# EAGLE design Super-Regenerative-FM-KosmosX3000 (EAGLE 7.2.0)
Kosmos X3000, UKW-Pendler mit FET 11.Mar.09 11:01 by Wolfgang Holtmann http://www.radiomuseum.org/forum/kosmos_x3000_ukw_pendler_mit_fet.html
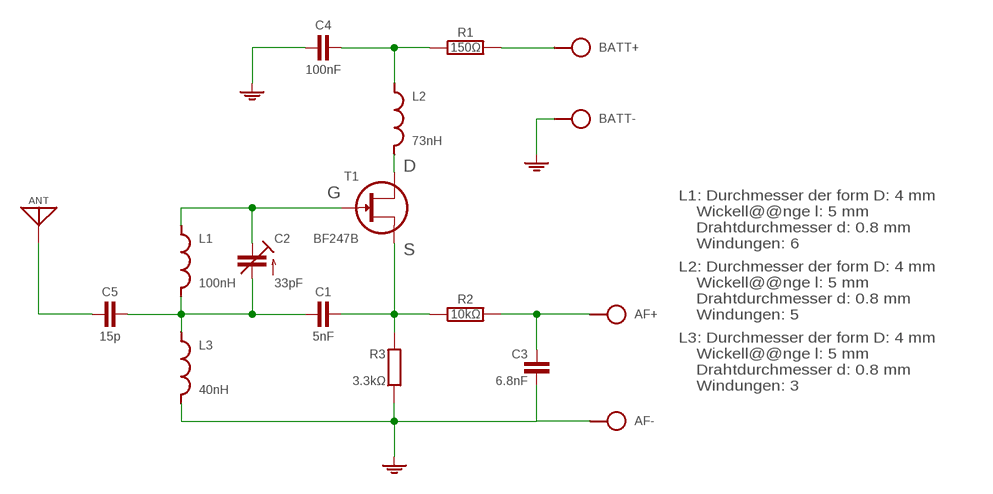
[diagram p0: schematic, sheet 1]

## Parts
AF  SPAD+-+-  [SPAD+-]
ANT  ANT  [SPAD]
BATT  SPAD+--+  [SPAD-+]
C1  5nF  C050-020X044  [C050-020X044]
C2  33pF  C-TR-PH201272222-808-2PIN  [TRIM-2222-808]
C3  6.8nF  C050-020X044  [C050-020X044]
C4  100nF  C050-020X044  [C050-020X044]
C5  15p  C025-015X024  [C025-015X024]
L1  100nH  L-SHORT04-5/5V-C  [L-04-5/6V-C]
L2  73nH  L-SHORT04-5/5V-C  [L-04-5/6V-C]
L3  40nH  L-SHORT04-5/5V-C  [L-04-5/6V-C]
R1  150Ω  R-H0204/15-V  [0204/15-V]
R2  10kΩ  R-H0204/10-V  [0204/10-V]
R3  3.3kΩ  R0204/10-V  [0204/10-V]
T1  BF247B  [TO92]

## Nets
GND: AF.1 BATT.1 C3.2 C4.2 L3.1 R3.2
N$1: C2.1(E) L1.2 T1.3(G)
N$2: C1.2 C2.2(A) C5.1 L1.1 L3.2
N$3: C4.1 L2.2 R1.1
N$4: AF.2 C3.1 R2.2
N$5: C1.1 R2.1 R3.1 T1.2(S)
N$6: L2.1 T1.1(D)
N$7: BATT.2 R1.2
N$8: ANT.1 C5.2

## Notes on the sheet
- L1: Durchmesser der form D: 4 mm
      Wickell@@nge l: 5 mm
      Drahtdurchmesser d: 0.8 mm
      Windungen: 6
- L2: Durchmesser der form D: 4 mm
      Wickell@@nge l: 5 mm
      Drahtdurchmesser d: 0.8 mm
      Windungen: 5
- L3: Durchmesser der form D: 4 mm
      Wickell@@nge l: 5 mm
      Drahtdurchmesser d: 0.8 mm
      Windungen: 3

## Library data of the parts
AF BATT = pad:SPAD+-
ANT = pad:ANT
C1 C3-C5 = c:C: CAPACITOR, European symbol
C2 = cap-trim:C-TR-PH20127
L1-L3 = l:L-SHORT
R1 R2 = r:R-H
R3 = r:R: RESISTOR, European symbol
T1 = t:BF247B

## Net classes
0 default: width 0.61 mm

## Board
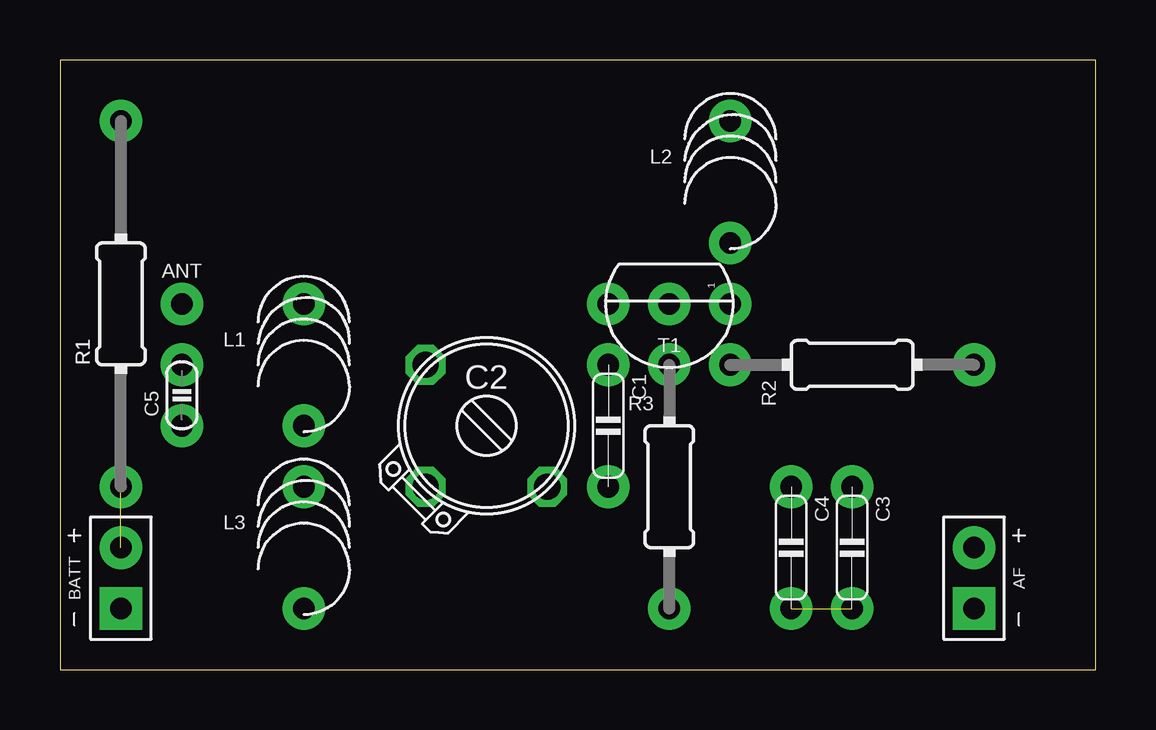
[diagram p1: board, top side]
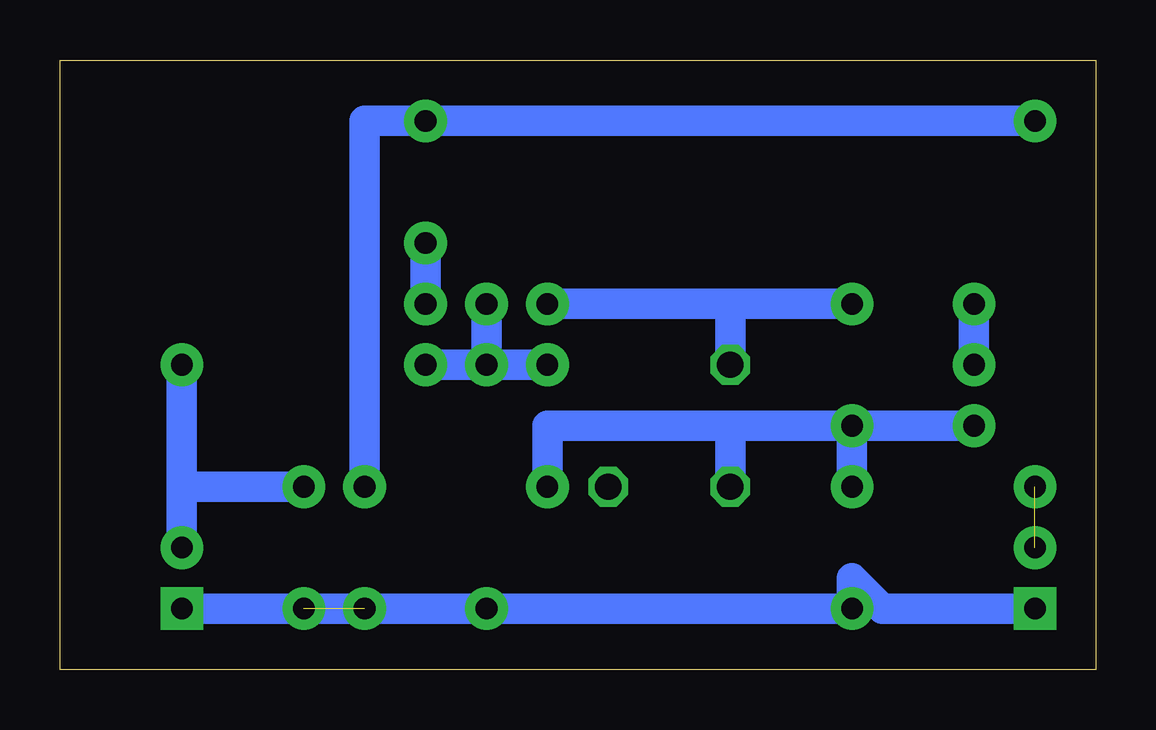
[diagram p2: board, bottom side, seen from below]

Size 43.18 x 25.4 mm. Coordinates in mm from the lower left corner, seen from the top.
Outline: 0,0 43.18,0 43.18,25.4 0,25.4 0,0
Copper layers (1*16): Top 0.035mm / dielectric 1.5mm / Bottom 0.035mm
Design rules "default": minimum track width 10mil, minimum drill 24mil, track to track 8mil, track to pad 8mil, pad to pad 8mil, via to via 8mil, smd to smd 8mil, copper to edge 40mil, drill to drill 8mil, minimum pad ring 10mil, minimum via ring 8mil, stop-mask expansion 4mil, vias tented up to drill 0mil, thermal gap 10mil

### Footprints (pad centres in the part's own frame; a part is rotated, then mirrored left to right if it is on the bottom)
SPAD+- = drill 0.9 pad 1.778 square: 1 0,-1.27 | drill 0.9 pad 1.778: 2 0,1.27
SPAD = drill 0.9 pad 1.778: 1 0,0
SPAD-+ = drill 0.9 pad 1.778 square: 1 0,-1.27 | drill 0.9 pad 1.778: 2 0,1.27
C050-020X044 = drill 0.9 pad 1.778: 1 -2.54,0; 2 2.54,0
TRIM-2222-808 = drill 1.1 octagon: 1 -2.54,2.54; 2 -2.54,-2.54; 3 2.54,-2.54
C025-015X024 = drill 0.9 pad 1.778: 1 -1.27,0; 2 1.27,0
L-04-5/6V-C = drill 0.9 pad 1.778: 1 0,-2.54; 2 0,2.54
0204/15-V = drill 0.9 pad 1.778: 1 0,7.62; 2 0,-7.62
0204/10-V = drill 0.9 pad 1.778: 1 0,5.08; 2 0,-5.08
TO92 = drill 0.9 pad 1.778: 1 0,2.54; 2 0,0; 3 0,-2.54

### Placement (x,y rotation side)
AF  38.1,3.81 0 top
ANT  5.08,15.24 270 top
BATT  2.54,3.81 0 top
C1  22.86,10.16 270 top
C2  17.78,10.16 0 top
C3  33.02,5.08 270 top
C4  30.48,5.08 270 top
C5  5.08,11.43 90 top
L1  10.16,12.7 0 top
L2  27.94,20.32 0 top
L3  10.16,5.08 0 top
R1  2.54,15.24 0 top
R2  33.02,12.7 90 top
R3  25.4,7.62 0 top
T1  25.4,15.24 270 top

### Tracks (layer width: path | path; a pad name or v marks a point on that pad's centre or on a via)
GND  (1 unrouted)
  Bottom 1.27: BATT.1 8.89,2.54 10.16,3.81 L3.1 R3.2 C4.2 AF.1
N$1
  Bottom 1.27: L1.2 15.24,15.24 | 15.24,15.24 T1.3 | C2.1 15.24,15.24
N$2
  Bottom 1.27: C5.1 L1.1 | L1.1 L3.2 | C1.2 22.86,10.16 15.24,10.16 | C2.2 15.24,10.16 | 15.24,10.16 L1.1
N$3
  Bottom 1.27: C4.1 30.48,22.86 L2.2 | 26.67,22.86 L2.2 | L2.2 R1.1
N$4
  Bottom 1.27: AF.2 38.1,7.62 | 38.1,7.62 R2.2 | C3.1 38.1,7.62
N$5
  Bottom 1.27: R3.1 R2.1 | T1.2 R3.1 | C1.1 R3.1
N$6
  Bottom 1.27: T1.1 L2.1
N$7  (1 unrouted)
N$8
  Bottom 1.27: ANT.1 C5.2